# Altium project PCB-20062-001.PrjPcb
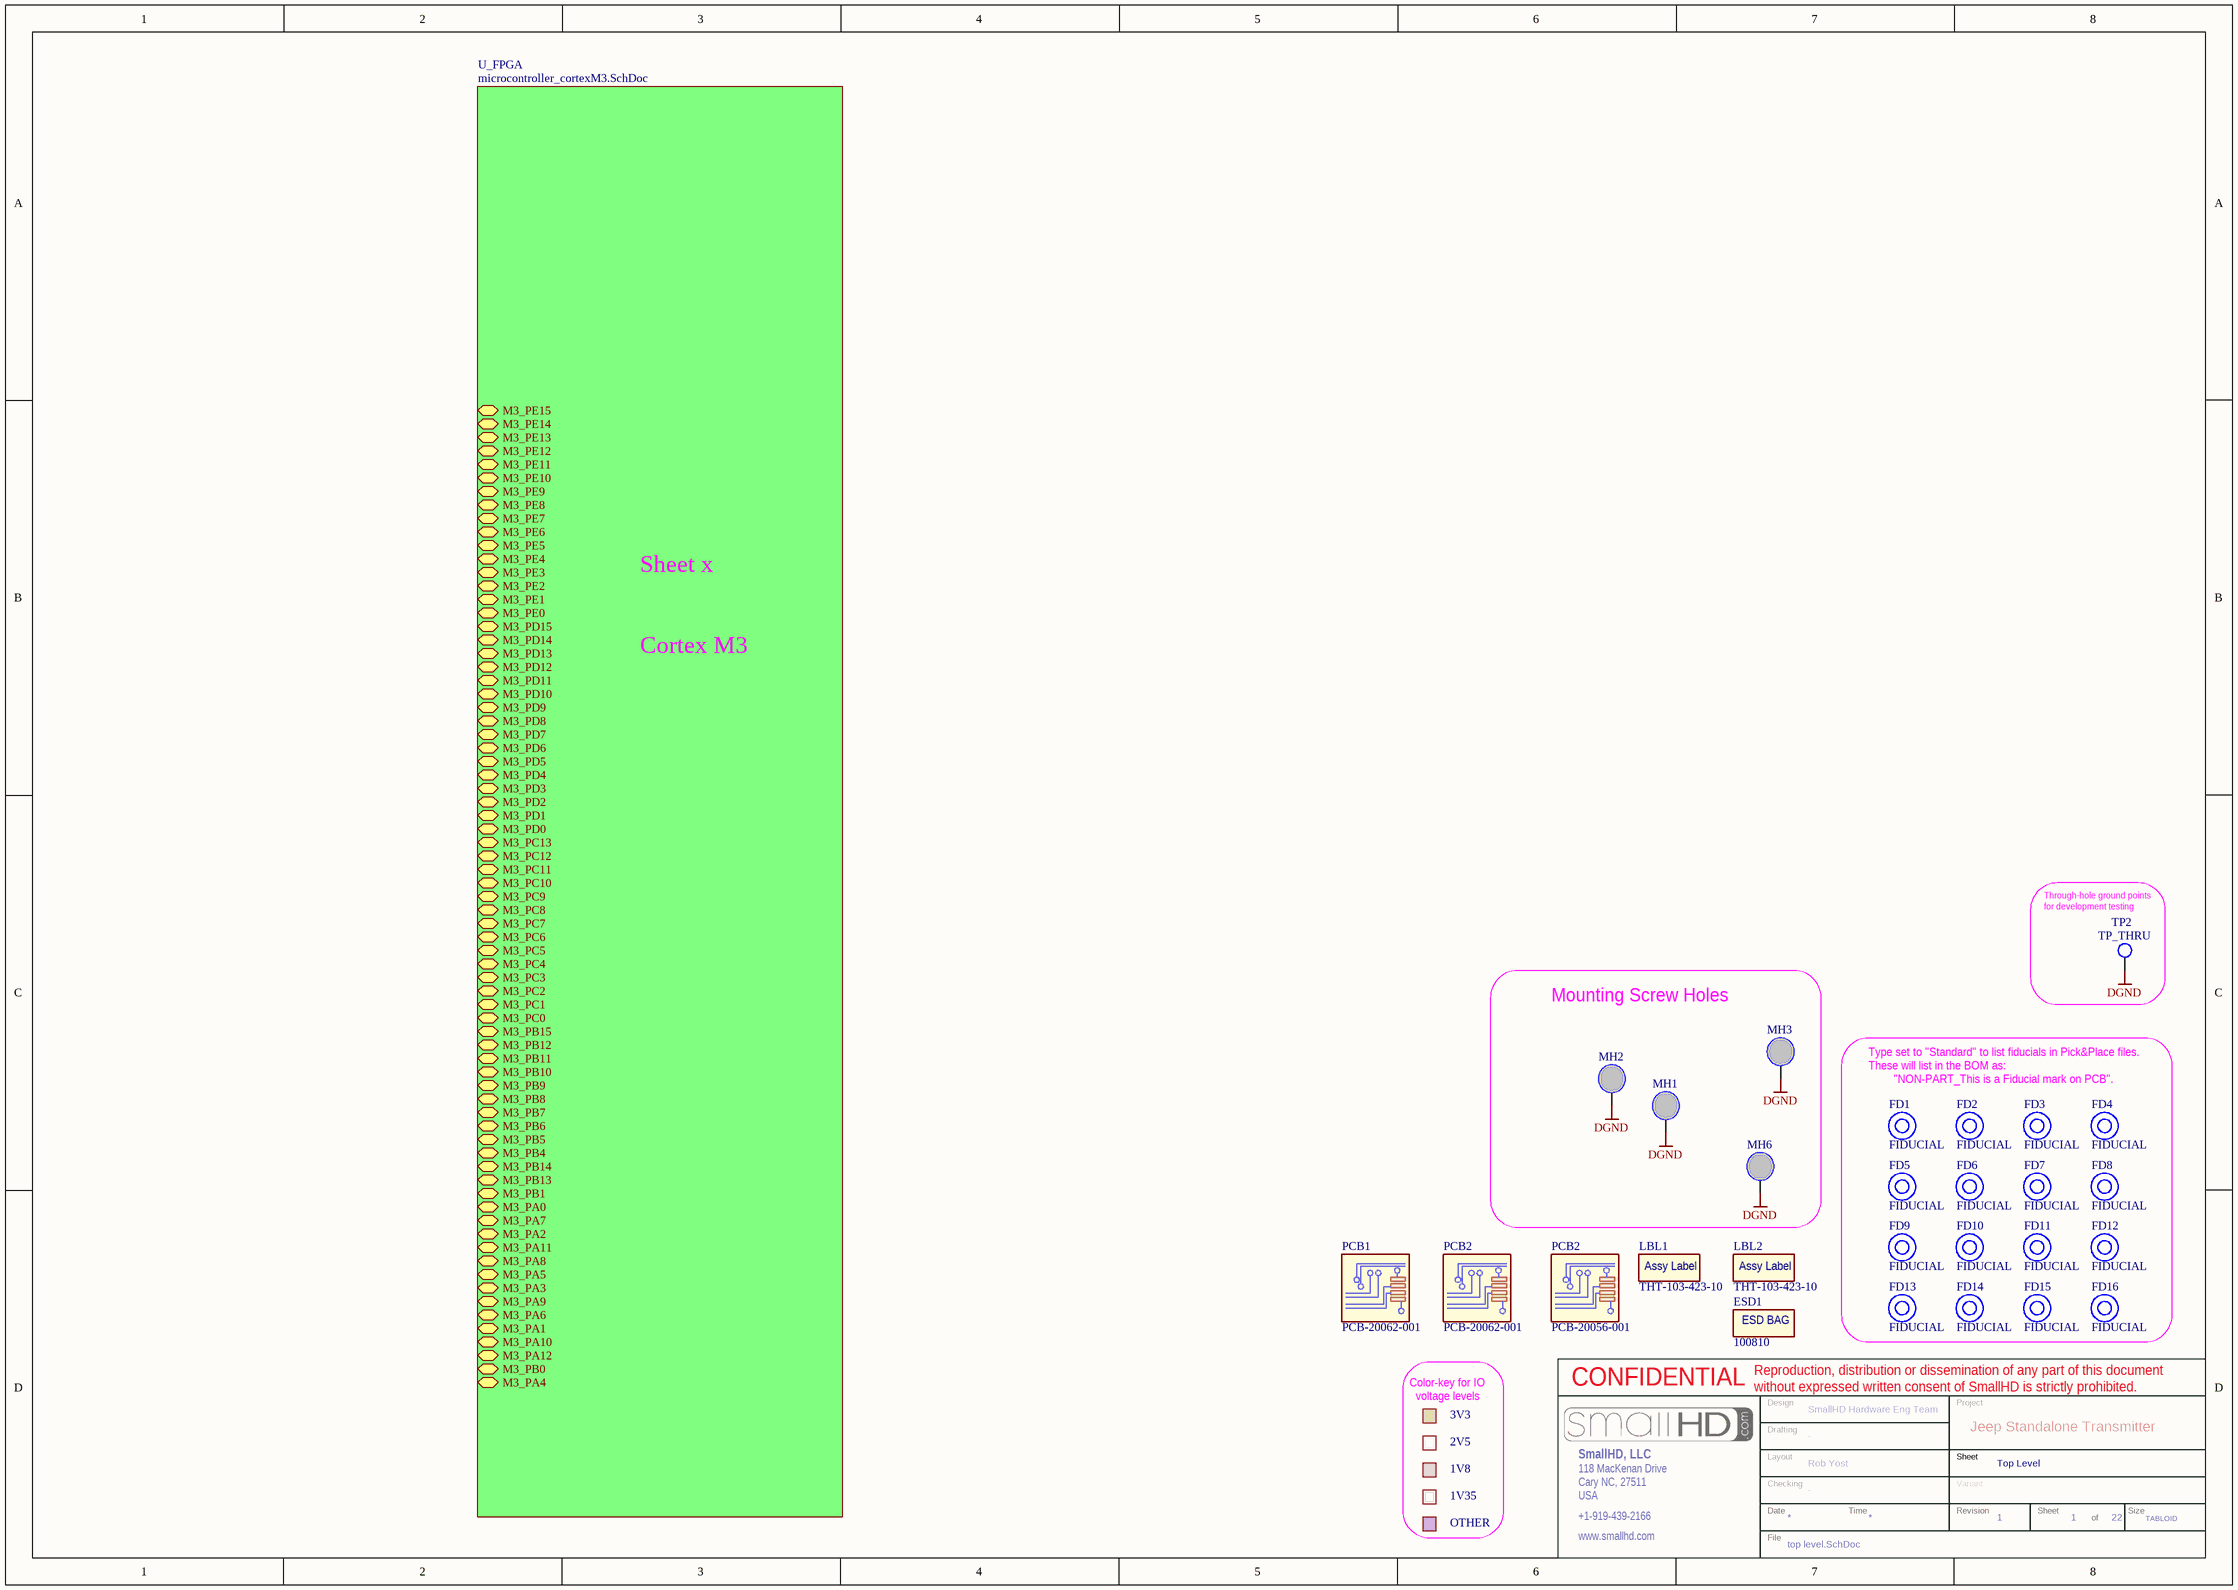
[diagram p0: top level.SchDoc]
Project_URL2: -; Project_URL1: www.smallhd.com; Project_SchemRev: 1; Project_Revision: 001; Project_ReviewedBy: SmallHD Hardware Eng Team; Project_Phone: +1-919-439-2166; Project_PCBRevision: 1; Project_PartNumber: PCB-20062-001; Project_LayoutBy: Rob Yost; Project_Freecall2: -; Project_Freecall1: -; Project_Filename: Jeep; Project_Fax: +1-919-882-0999; Project_DraftingBy: -; Project_DocRevision: 1; Project_DesignBy: SmallHD Hardware Eng Team; Project_Description: Jeep Standalone Transmitter; Project_ComponentsBy: -; Project_CheckingBy: -; Project_Board_Name: -; Project_Address5: -; Project_Address4: USA; Project_Address3: Cary NC, 27511; Project_Address2: 118 MacKenan Drive; Project_Address1: SmallHD, LLC
3 sheets, 88 parts. Net scope: hierarchical (ports join the sheet entries above them; power ports are global).
Board file: PCB-20062-001.PcbDoc
Sheets:
  top level.SchDoc
    U_FPGA = microcontroller_cortexM3.SchDoc
  ethernet.SchDoc

## Sheet top level.SchDoc: Top Level
size 419 x 297 mm; Layout: Rob Yost; Address6: Project_Address6; Components: -; ApprovedBy: -; CheckedBy: -; Author: SmallHD Hardware Eng Team; CompanyName: NOT USED; Address1: SmallHD, LLC; Address2: 118 MacKenan Drive; Address3: Cary NC, 27511; Address4: USA; DocumentNumber: 1; SheetNumber: 1; SheetTotal: 22; Address5: -; PageSetup: Record=PageOptions|CenterHorizontal=True|CenterVertical=True|PrintScale=1.00|XCorrection=1.00|YCorrection=1.00|PrintKind=0|BorderSize=5000000|LeftOffset=0|BottomOffset=0|Orientation=2|PaperLength=1000|PaperWidth=1000|Scale=100|PaperSource=7|PrintQuality=-4|MediaType=1|DitherType=10|PaperKind=A3|PrintScaleMode=0

### Parts
(Parts that share a designator on the sheet are numbered #1, #2 ... from top to bottom, then left to right.)
ESD1  100810  (mechanical)
FD1  FIDUCIAL  [FID10X20]
FD2  FIDUCIAL  [FID10X20]
FD3  FIDUCIAL  [FID10X20]
FD4  FIDUCIAL  [FID10X20]
FD5  FIDUCIAL  [FID10X20]
FD6  FIDUCIAL  [FID10X20]
FD7  FIDUCIAL  [FID10X20]
FD8  FIDUCIAL  [FID10X20]
FD9  FIDUCIAL  [FID10X20]
FD10  FIDUCIAL  [FID10X20]
FD11  FIDUCIAL  [FID10X20]
FD12  FIDUCIAL  [FID10X20]
FD13  FIDUCIAL  [FID10X20]
FD14  FIDUCIAL  [FID10X20]
FD15  FIDUCIAL  [FID10X20]
FD16  FIDUCIAL  [FID10X20]
LBL1  THT-103-423-10  [Assembly_Label_LBL1]
LBL2  THT-103-423-10  [Assembly_Label_LBL2]
MH1  SCREW-HOLE  [M3_buttonhead_hex]  (value not drawn)  (no BOM)
MH2  SCREW-HOLE  [M3_buttonhead_hex]  (value not drawn)  (no BOM)
MH3  SCREW-HOLE  [M3_buttonhead_hex]  (value not drawn)  (no BOM)
MH6  SCREW-HOLE  [M3_buttonhead_hex]  (value not drawn)  (no BOM)
PCB1  PCB-20062-001  [LOGO_SmallHD_4]
PCB2#1  PCB-20062-001  [LOGO_SmallHD_4]  (no BOM)
PCB2#2  PCB-20056-001  [LOGO_SmallHD_4]  (no BOM)
TP2  TP_THRU  [TP_THRU_1]  (no BOM)

### Sub-sheets
U_FPGA = microcontroller_cortexM3.SchDoc: M3_PE15 (bidir), M3_PE14 (bidir), M3_PE13 (bidir), M3_PE12 (bidir), M3_PE11 (bidir), M3_PE10 (bidir), M3_PE9 (bidir), M3_PE8 (bidir), M3_PE7 (bidir), M3_PE6 (bidir), M3_PE5 (bidir), M3_PE4 (bidir), M3_PE3 (bidir), M3_PE2 (bidir), M3_PE1 (bidir), M3_PE0 (bidir), M3_PD15 (bidir), M3_PD14 (bidir), M3_PD13 (bidir), M3_PD12 (bidir), M3_PD11 (bidir), M3_PD10 (bidir), M3_PD9 (bidir), M3_PD8 (bidir), M3_PD7 (bidir), M3_PD6 (bidir), M3_PD5 (bidir), M3_PD4 (bidir), M3_PD3 (bidir), M3_PD2 (bidir), M3_PD1 (bidir), M3_PD0 (bidir), M3_PC13 (bidir), M3_PC12 (bidir), M3_PC11 (bidir), M3_PC10 (bidir), M3_PC9 (bidir), M3_PC8 (bidir), M3_PC7 (bidir), M3_PC6 (bidir), M3_PC5 (bidir), M3_PC4 (bidir), M3_PC3 (bidir), M3_PC2 (bidir), M3_PC1 (bidir), M3_PC0 (bidir), M3_PB15 (bidir), M3_PB12 (bidir), M3_PB11 (bidir), M3_PB10 (bidir), M3_PB9 (bidir), M3_PB8 (bidir), M3_PB7 (bidir), M3_PB6 (bidir), M3_PB5 (bidir), M3_PB4 (bidir), M3_PB14 (bidir), M3_PB13 (bidir), M3_PB1 (bidir), M3_PA0 (bidir), M3_PA7 (bidir), M3_PA2 (bidir), M3_PA11 (bidir), M3_PA8 (bidir), M3_PA5 (bidir), M3_PA3 (bidir), M3_PA9 (bidir), M3_PA6 (bidir), M3_PA1 (bidir), M3_PA10 (bidir), M3_PA12 (bidir), M3_PB0 (bidir), M3_PA4 (bidir)  | 1: Sheet x; 4: Cortex M3

### Nets
DGND: MH1.1 MH2.1 MH3.1 MH6.1 TP2.1

Not connected (* = marked no-connect by the designer): FD1 0; FD2 0; FD3 0; FD4 0; FD5 0; FD6 0; FD7 0; FD8 0; FD9 0; FD10 0; FD11 0; FD12 0; FD13 0; FD14 0; FD15 0; FD16 0

### Notes on the sheet
- (near TP2) Through-hole ground points
  for development testing
- Mounting Screw Holes
- Type set to "Standard" to list fiducials in Pick&Place files.
  These will list in the BOM as:
  "NON-PART_This is a Fiducial mark on PCB".
- Color-key for IO
  voltage levels
- 3V3
- 2V5
- 1V8
- OTHER
- 1V35
- CONFIDENTIAL
- Reproduction, distribution or dissemination of any part of this document without expressed written consent of SmallHD is strictly prohibited.
- Design
- Project
- Drafting
- Layout
- Sheet
- Date
- File
- Checking
- Time
- Variant
- Revision
- of
- Size
- TABLOID
- (in symbol ESD-20001-001) ESD BAG
- (in symbol LBL-20002-001) Assy Label
- (in symbol LBL-20003-001) Assy Label

### Library data of the parts
ESD1 = ESD-20001-001: BAG STATIC METL-IN 8X10" OPEN TOP; Manufacturer: SCS; Display_Name: 100810; Schematic Symbol: ESDBAG_1; smallHD PN: ESD-20001-001; Manufacturer Part Number: 100810
FD1-FD16 = NPT-20003-001: NON-PART_This is a Fiducial mark on PCB; Display_Name: FIDUCIAL; Schematic Symbol: FIDUCIAL_BOMandPick&Place; smallHD PN: NPT-20003-001
LBL1 = LBL-20002-001: LABEL 1.0 x 0.25 inch Thermal polyester; Manufacturer: Brady; Display_Name: THT-103-423-10; smallHD PN: LBL-20002-001; Manufacturer Part Number: THT-103-423-10
LBL2 = LBL-20003-001: LABEL 1.0 x 0.25 inch Thermal polyester; Manufacturer: Brady; Display_Name: THT-103-423-10; smallHD PN: LBL-20003-001; Manufacturer Part Number: THT-103-423-10
MH1-MH3 MH6 = NPT-20017-001: M3 x 0.5 mm Button-Head Socket Cap Screw 2 mm Hex; Display_Name: SCREW-HOLE; smallHD PN: NPT-20017-001; Display Footprint: M3_buttonhead_hex
PCB1 PCB2#1 = PCB-20062-001: PCB Jeep REV 001; Manufacturer: PCB FAB; Schematic Symbol: PCB_1; smallHD PN: PCB-20062-001; Manufacturer Part Number: PCB-20062-001; Display_Name: PCB-20062-001
PCB2#2 = PCB-20056-001: PCB Fiesta-5W SDI MAIN REV 001; Manufacturer: PCB FAB; Schematic Symbol: PCB_1; smallHD PN: PCB-20056-001; Manufacturer Part Number: PCB-20056-001; Display_Name: PCB-20056-001
TP2 = NPT-20014-001: Test Point - THRU; Display_Name: TP_THRU; Schematic Symbol: TP_1; smallHD PN: NPT-20014-001; Display Footprint: TP_THRU

## Sheet microcontroller_cortexM3.SchDoc: Cortex M3 Microcontroller
size 419 x 297 mm; Layout: Rob Yost; Address6: Project_Address6; Components: -; ApprovedBy: -; CheckedBy: -; Author: SmallHD Hardware Eng Team; CompanyName: NOT USED; Address1: SmallHD, LLC; Address2: 118 MacKenan Drive; Address3: Cary NC, 27511; Address4: USA; DocumentNumber: 22; SheetNumber: 22; SheetTotal: 22; Address5: -; PageSetup: Record=PageOptions|CenterHorizontal=True|CenterVertical=True|PrintScale=1.00|XCorrection=1.00|YCorrection=1.00|PrintKind=0|BorderSize=5000000|LeftOffset=0|BottomOffset=0|Orientation=2|PaperLength=1000|PaperWidth=1000|Scale=100|PaperSource=7|PrintQuality=-4|MediaType=1|DitherType=10|PaperKind=A3|PrintScaleMode=0
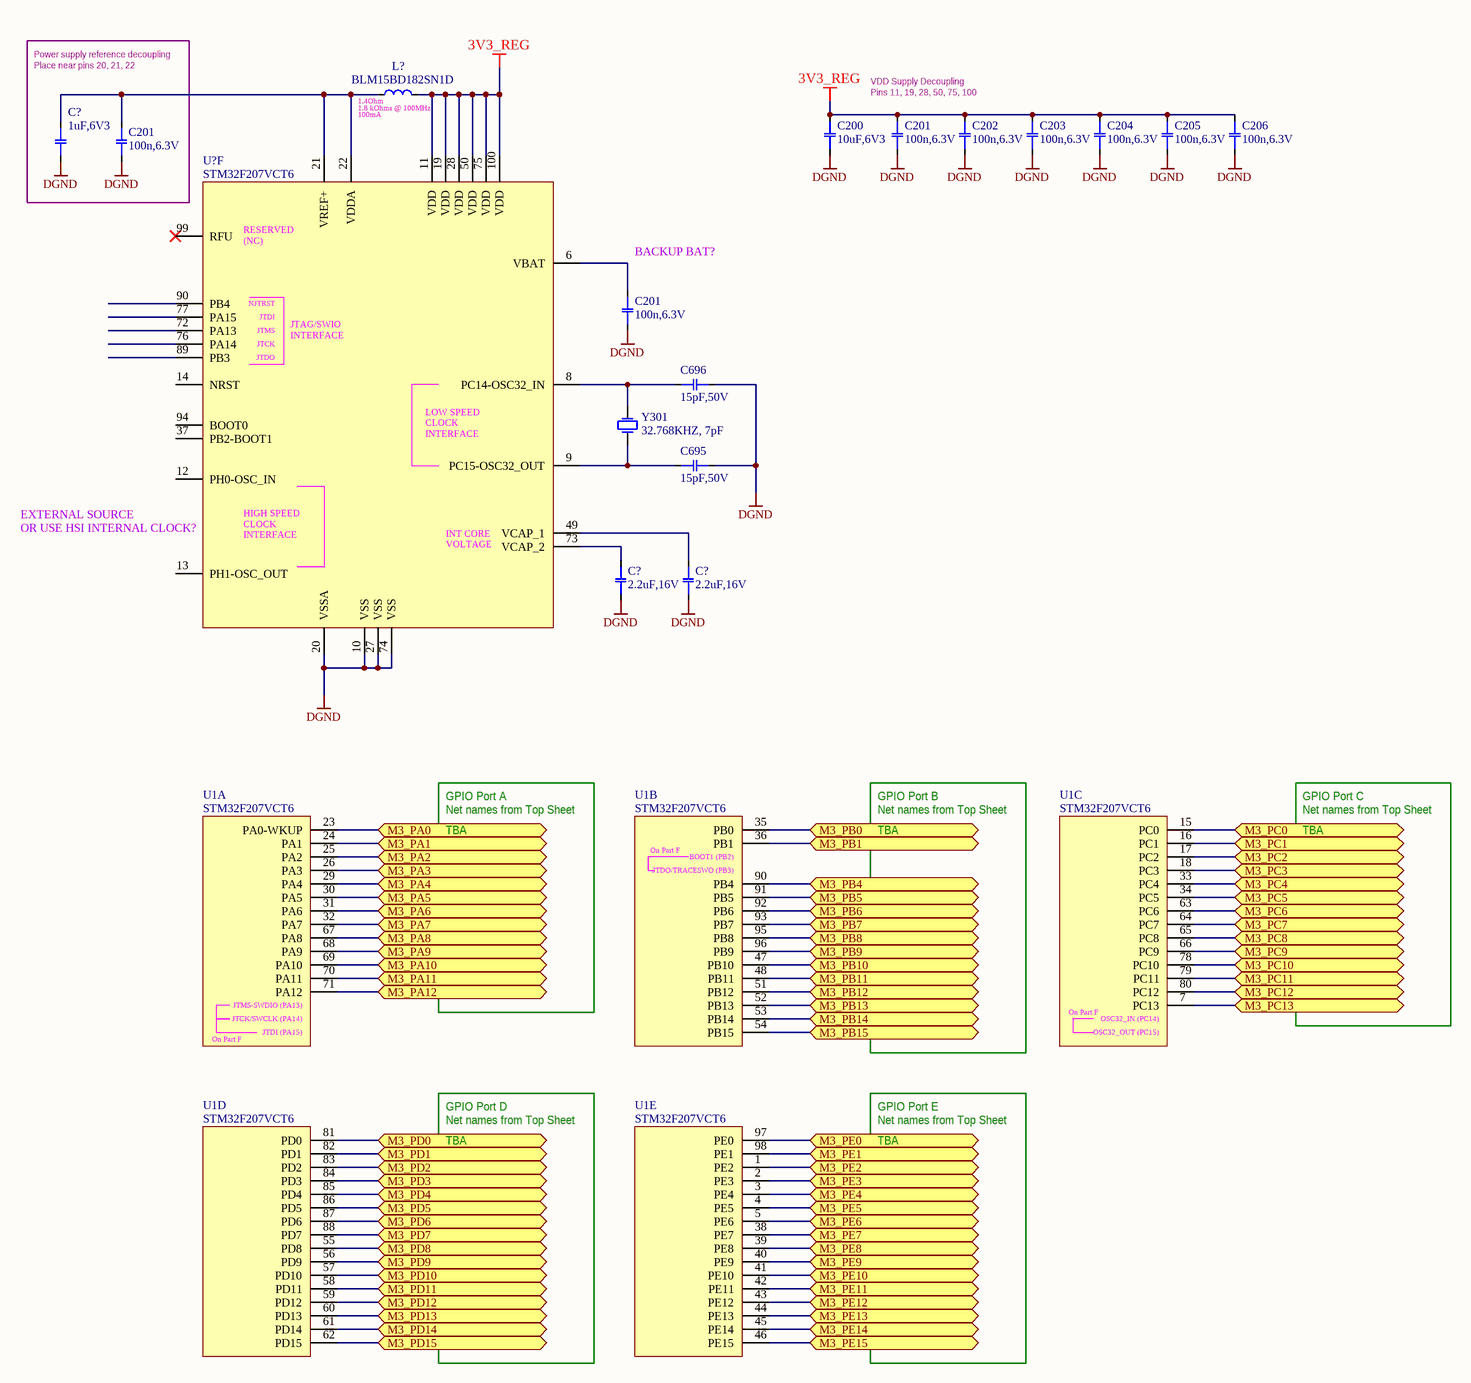
[diagram p1: microcontroller_cortexM3.SchDoc]

### Parts
(Parts that share a designator on the sheet are numbered #1, #2 ... from top to bottom, then left to right.)
C200  10uF,6V3  [CAPC1608X10N_0603]
C201#1  100n,6.3V  [CAPC0603X03L_0201]
C201#2  100n,6.3V  [CAPC0603X03L_0201]
C201#3  100n,6.3V  [CAPC0603X03L_0201]
C202  100n,6.3V  [CAPC0603X03L_0201]
C203  100n,6.3V  [CAPC0603X03L_0201]
C204  100n,6.3V  [CAPC0603X03L_0201]
C205  100n,6.3V  [CAPC0603X03L_0201]
C206  100n,6.3V  [CAPC0603X03L_0201]
C695  15pF,50V  [CAPC1005X05N_0402]
C696  15pF,50V  [CAPC1005X05N_0402]
C?#1  1uF,6V3  [CAPC1005X06N_0402]
C?#2  2.2uF,16V  [CAPC1005X06N_0402]
C?#3  2.2uF,16V  [CAPC1005X06N_0402]
L?  BLM15BD182SN1D  Current Rating: 100mA  DC Resistance: 1.4Ohm  Impedance @ Frequency: 1.8 kOhms @ 100MHz  [INDC1005X06N_0402]
U1  STM32F207VCT6  [LQFP50P1600X1600X160-100N]  (parts A,B,C,D,E of 6)
U?  STM32F207VCT6  [LQFP50P1600X1600X160-100N]  (part F of 6)
Y301  32.768KHZ, 7pF  [XTAL_ABS07]

### Ports
M3_PA0 (bidir), M3_PA1 (bidir), M3_PA2 (bidir), M3_PA3 (bidir), M3_PA4 (bidir), M3_PA5 (bidir), M3_PA6 (bidir), M3_PA7 (bidir), M3_PA8 (bidir), M3_PA9 (bidir), M3_PA10 (bidir), M3_PA11 (bidir), M3_PA12 (bidir), M3_PB0 (bidir), M3_PB1 (bidir), M3_PB4 (bidir), M3_PB5 (bidir), M3_PB6 (bidir), M3_PB7 (bidir), M3_PB8 (bidir), M3_PB9 (bidir), M3_PB10 (bidir), M3_PB11 (bidir), M3_PB12 (bidir), M3_PB13 (bidir), M3_PB14 (bidir), M3_PB15 (bidir), M3_PC0 (bidir), M3_PC1 (bidir), M3_PC2 (bidir), M3_PC3 (bidir), M3_PC4 (bidir), M3_PC5 (bidir), M3_PC6 (bidir), M3_PC7 (bidir), M3_PC8 (bidir), M3_PC9 (bidir), M3_PC10 (bidir), M3_PC11 (bidir), M3_PC12 (bidir), M3_PC13 (bidir), M3_PD0 (bidir), M3_PD1 (bidir), M3_PD2 (bidir), M3_PD3 (bidir), M3_PD4 (bidir), M3_PD5 (bidir), M3_PD6 (bidir), M3_PD7 (bidir), M3_PD8 (bidir), M3_PD9 (bidir), M3_PD10 (bidir), M3_PD11 (bidir), M3_PD12 (bidir), M3_PD13 (bidir), M3_PD14 (bidir), M3_PD15 (bidir), M3_PE0 (bidir), M3_PE1 (bidir), M3_PE2 (bidir), M3_PE3 (bidir), M3_PE4 (bidir), M3_PE5 (bidir), M3_PE6 (bidir), M3_PE7 (bidir), M3_PE8 (bidir), M3_PE9 (bidir), M3_PE10 (bidir), M3_PE11 (bidir), M3_PE12 (bidir), M3_PE13 (bidir), M3_PE14 (bidir), M3_PE15 (bidir)

### Nets
3V3_REG: C200.2 C201#1.2 C202.2 C203.2 C204.2 C205.2 C206.2 L?.2 U?.11(VDD) U?.19(VDD) U?.28(VDD) U?.50(VDD) U?.75(VDD) U?.100(VDD)
DGND: C200.1 C201#1.1 C201#2.1 C201#3.1 C202.1 C203.1 C204.1 C205.1 C206.1 C695.1 C696.1 C?#1.1 C?#2.1 C?#3.1 U?.10(VSS) U?.20(VSSA) U?.27(VSS) U?.74(VSS)
NetC201#2_2: C201#2.2 C?#1.2 L?.1 U?.21(VREF+) U?.22(VDDA)
NetC201#3_2: C201#3.2 U?.6(VBAT)
NetC695_2: C695.2 U?.9(PC15-OSC32_OUT) Y301.1
NetC696_2: C696.2 U?.8(PC14-OSC32_IN) Y301.2
NetC?#2_2: C?#2.2 U?.73(VCAP_2)
NetC?#3_2: C?#3.2 U?.49(VCAP_1)
NetU1_1: U1.1(PE2) ; port M3_PE2
NetU1_2: U1.2(PE3) ; port M3_PE3
NetU1_3: U1.3(PE4) ; port M3_PE4
NetU1_4: U1.4(PE5) ; port M3_PE5
NetU1_5: U1.5(PE6) ; port M3_PE6
NetU1_7: U1.7(PC13) ; port M3_PC13
NetU1_15: U1.15(PC0) ; port M3_PC0
NetU1_16: U1.16(PC1) ; port M3_PC1
NetU1_17: U1.17(PC2) ; port M3_PC2
NetU1_18: U1.18(PC3) ; port M3_PC3
NetU1_23: U1.23(PA0-WKUP) ; port M3_PA0
NetU1_24: U1.24(PA1) ; port M3_PA1
NetU1_25: U1.25(PA2) ; port M3_PA2
NetU1_26: U1.26(PA3) ; port M3_PA3
NetU1_29: U1.29(PA4) ; port M3_PA4
NetU1_30: U1.30(PA5) ; port M3_PA5
NetU1_31: U1.31(PA6) ; port M3_PA6
NetU1_32: U1.32(PA7) ; port M3_PA7
NetU1_33: U1.33(PC4) ; port M3_PC4
NetU1_34: U1.34(PC5) ; port M3_PC5
NetU1_35: U1.35(PB0) ; port M3_PB0
NetU1_36: U1.36(PB1) ; port M3_PB1
NetU1_38: U1.38(PE7) ; port M3_PE7
NetU1_39: U1.39(PE8) ; port M3_PE8
NetU1_40: U1.40(PE9) ; port M3_PE9
NetU1_41: U1.41(PE10) ; port M3_PE10
NetU1_42: U1.42(PE11) ; port M3_PE11
NetU1_43: U1.43(PE12) ; port M3_PE12
NetU1_44: U1.44(PE13) ; port M3_PE13
NetU1_45: U1.45(PE14) ; port M3_PE14
NetU1_46: U1.46(PE15) ; port M3_PE15
NetU1_47: U1.47(PB10) ; port M3_PB10
NetU1_48: U1.48(PB11) ; port M3_PB11
NetU1_51: U1.51(PB12) ; port M3_PB12
NetU1_52: U1.52(PB13) ; port M3_PB13
NetU1_53: U1.53(PB14) ; port M3_PB14
NetU1_54: U1.54(PB15) ; port M3_PB15
NetU1_55: U1.55(PD8) ; port M3_PD8
NetU1_56: U1.56(PD9) ; port M3_PD9
NetU1_57: U1.57(PD10) ; port M3_PD10
NetU1_58: U1.58(PD11) ; port M3_PD11
NetU1_59: U1.59(PD12) ; port M3_PD12
NetU1_60: U1.60(PD13) ; port M3_PD13
NetU1_61: U1.61(PD14) ; port M3_PD14
NetU1_62: U1.62(PD15) ; port M3_PD15
NetU1_63: U1.63(PC6) ; port M3_PC6
NetU1_64: U1.64(PC7) ; port M3_PC7
NetU1_65: U1.65(PC8) ; port M3_PC8
NetU1_66: U1.66(PC9) ; port M3_PC9
NetU1_67: U1.67(PA8) ; port M3_PA8
NetU1_68: U1.68(PA9) ; port M3_PA9
NetU1_69: U1.69(PA10) ; port M3_PA10
NetU1_70: U1.70(PA11) ; port M3_PA11
NetU1_71: U1.71(PA12) ; port M3_PA12
NetU1_78: U1.78(PC10) ; port M3_PC10
NetU1_79: U1.79(PC11) ; port M3_PC11
NetU1_80: U1.80(PC12) ; port M3_PC12
NetU1_81: U1.81(PD0) ; port M3_PD0
NetU1_82: U1.82(PD1) ; port M3_PD1
NetU1_83: U1.83(PD2) ; port M3_PD2
NetU1_84: U1.84(PD3) ; port M3_PD3
NetU1_85: U1.85(PD4) ; port M3_PD4
NetU1_86: U1.86(PD5) ; port M3_PD5
NetU1_87: U1.87(PD6) ; port M3_PD6
NetU1_88: U1.88(PD7) ; port M3_PD7
NetU1_90: U1.90(PB4) ; port M3_PB4
NetU1_91: U1.91(PB5) ; port M3_PB5
NetU1_92: U1.92(PB6) ; port M3_PB6
NetU1_93: U1.93(PB7) ; port M3_PB7
NetU1_95: U1.95(PB8) ; port M3_PB8
NetU1_96: U1.96(PB9) ; port M3_PB9
NetU1_97: U1.97(PE0) ; port M3_PE0
NetU1_98: U1.98(PE1) ; port M3_PE1

Not connected (* = marked no-connect by the designer): U? 12(PH0-OSC_IN) 13(PH1-OSC_OUT) 14(NRST) 37(PB2-BOOT1) 72(PA13) 76(PA14) 77(PA15) 89(PB3) 90(PB4) 94(BOOT0) 99(RFU)*

### Notes on the sheet
- Power supply reference decoupling
  Place near pins 20, 21, 22
- VDD Supply Decoupling
  Pins 11, 19, 28, 50, 75, 100
- (near C201#3) BACKUP BAT?
- (near U?) EXTERNAL SOURCE
  OR USE HSI INTERNAL CLOCK?
- Net names from Top Sheet
- GPIO Port A
- GPIO Port B
- GPIO Port C
- TBA
- GPIO Port D
- GPIO Port E
- CONFIDENTIAL
- Reproduction, distribution or dissemination of any part of this document without expressed written consent of SmallHD is strictly prohibited.
- Design
- Project
- Drafting
- Layout
- Sheet
- Date
- File
- Checking
- Time
- Variant
- Revision
- of
- Size
- TABLOID
- (in symbol ICT-20168-001, part A) JTMS-SWDIO (PA13); JTCK/SWCLK (PA14); JTDI (PA15); On Part F
- (in symbol ICT-20168-001, part B) On Part F; BOOT1 (PB2); JTDO/TRACESWO (PB3)
- (in symbol ICT-20168-001, part C) On Part F; OSC32_IN (PC14); OSC32_OUT (PC15)
- (in symbol ICT-20168-001, part F) RESERVED (NC); NJTRST; JTDI; JTMS; JTCK; JTAG/SWIO / INTERFACE; JTDO; LOW SPEED / CLOCK INTERFACE /; HIGH SPEED / CLOCK INTERFACE /; INT CORE / VOLTAGE

### Library data of the parts
C200 = CAP-20026-101: CAP CER 10UF 6.3V 20% X5R 0603; Manufacturer: TDK; Manufacturer Part Number: C1608X5R0J106M080AB; Manufacturer-2 Part Number: GRM188R60J106ME47J; Capacitance: 0.1uF; Type: Ceramic; Display_Name: 10uF,6V3; Dielectric: X5R; Tolerance: 20%; Voltage: 6.3V; Manufacturer-2: Murata; Schematic Symbol: CAP-NP_1; smallHD PN: CAP-20026-101
C201#1-C201#3 C202-C206 = CAP-20025-101: CAP CER 0.1UF 6.3V 20% X5R 0201; Manufacturer: TDK; Manufacturer Part Number: C0603X5R0J104M030BC; Manufacturer-2 Part Number: GRM033R60J104ME19D; Type: Ceramic; Display_Name: 100n,6.3V; Capacitance: 0.1uF; Dielectric: X5R; Tolerance: 20%; Voltage: 6.3V; Manufacturer-2: Murata; Schematic Symbol: CAP-NP_1; smallHD PN: CAP-20025-101
C695 C696 = CAP-20029-101: CAP CER 15PF 50V 5% NPO 0402; Manufacturer: Yageo; Manufacturer Part Number: CC0402JRNPO9BN150; Manufacturer-2 Part Number: GRM1555C1E150JA01D; Type: Ceramic; Display Footprint: 0402; Display_Name: 15pF,50V; Capacitance: 15pF; Dielectric: NPO; Tolerance: 5%; Voltage: 50V; Schematic Symbol: CAP-NP_1; Manufacturer-2: Murata; smallHD PN: CAP-20029-101
C?#1 = CAP-20023-101: CAP CER 1UF 6.3V 10% X5R 0402; Manufacturer: AVX; Manufacturer Part Number: 04026D105KAT2A; Manufacturer-2 Part Number: GRM155R60J105KE19D; Capacitance: 1.0uF; Type: Ceramic; Display Footprint: 0402; Display_Name: 1uF,6V3; Dielectric: X5R; Tolerance: 10%; Voltage: 6.3V; Schematic Symbol: CAP-NP_1; smallHD PN: CAP-20023-101; Thickness (Max): 0.56mm; Manufacturer-2: Murata
C?#2 C?#3 = CAP-20053-001: CAP CER 2.2uF 16V X5R 0402; Manufacturer: Murata; Manufacturer Part Number: GRM155R61C225KE11D; Tolerance: 10%; Type: Ceramic; Display Footprint: 0402; Display_Name: 2.2uF,16V; Capacitance: 2.2uF; Dielectric: X5R; Voltage: 16V; Schematic Symbol: CAP-NP_1; smallHD PN: CAP-20053-001; Thickness (Max): 0.55mm
L? = IND-20049-001: FERRITE BEAD 1.8 KOHM 0402 1LN; Manufacturer: Murata; Flex Footprint 1: INDC1005X06N_0402_FLEX; Display Footprint: 0402; Display_Name: BLM15BD182SN1D; Schematic Symbol: INDUCTOR_1; smallHD PN: IND-20049-001; Thickness (Max): 0.55mm; Manufacturer Part Number: BLM15BD182SN1D
U1 U? = ICT-20168-001: IC MCU 32BIT 256KB FLASH 100LQFP; Manufacturer: STMicroelectronics; Temp Range: -40°C ~ 85°C; Display Footprint: 100-LQFP; Display_Name: STM32F207VCT6; smallHD PN: ICT-20168-001; Manufacturer Part Number: STM32F207VCT6
Y301 = XTL-20001-001: CRYSTAL 32.768KHZ 7PF SMD; Manufacturer: Abracon Corporation; Manufacturer Part Number: ABS07-32.768KHZ-7-T; Accuracy: +-20ppm; Frequency: 32768Hz; Display Footprint: ABS07; Display_Name: 32.768KHZ, 7pF; Load Capacitance: 7pF; Schematic Symbol: XTAL_1; smallHD PN: XTL-20001-001

## Sheet ethernet.SchDoc: Ethernet
size 419 x 297 mm; Layout: Rob Yost; Address6: Project_Address6; Components: -; ApprovedBy: -; CheckedBy: -; Author: SmallHD Hardware Eng Team; CompanyName: NOT USED; Address1: SmallHD, LLC; Address2: 118 MacKenan Drive; Address3: Cary NC, 27511; Address4: USA; DocumentNumber: 24; SheetNumber: 24; SheetTotal: 29; Address5: -; PageSetup: Record=PageOptions|CenterHorizontal=True|CenterVertical=True|PrintScale=1.00|XCorrection=1.00|YCorrection=1.00|PrintKind=0|BorderSize=5000000|LeftOffset=0|BottomOffset=0|Orientation=2|PaperLength=1000|PaperWidth=1000|Scale=100|PaperSource=7|PrintQuality=-4|MediaType=1|DitherType=10|PaperKind=A3|PrintScaleMode=0
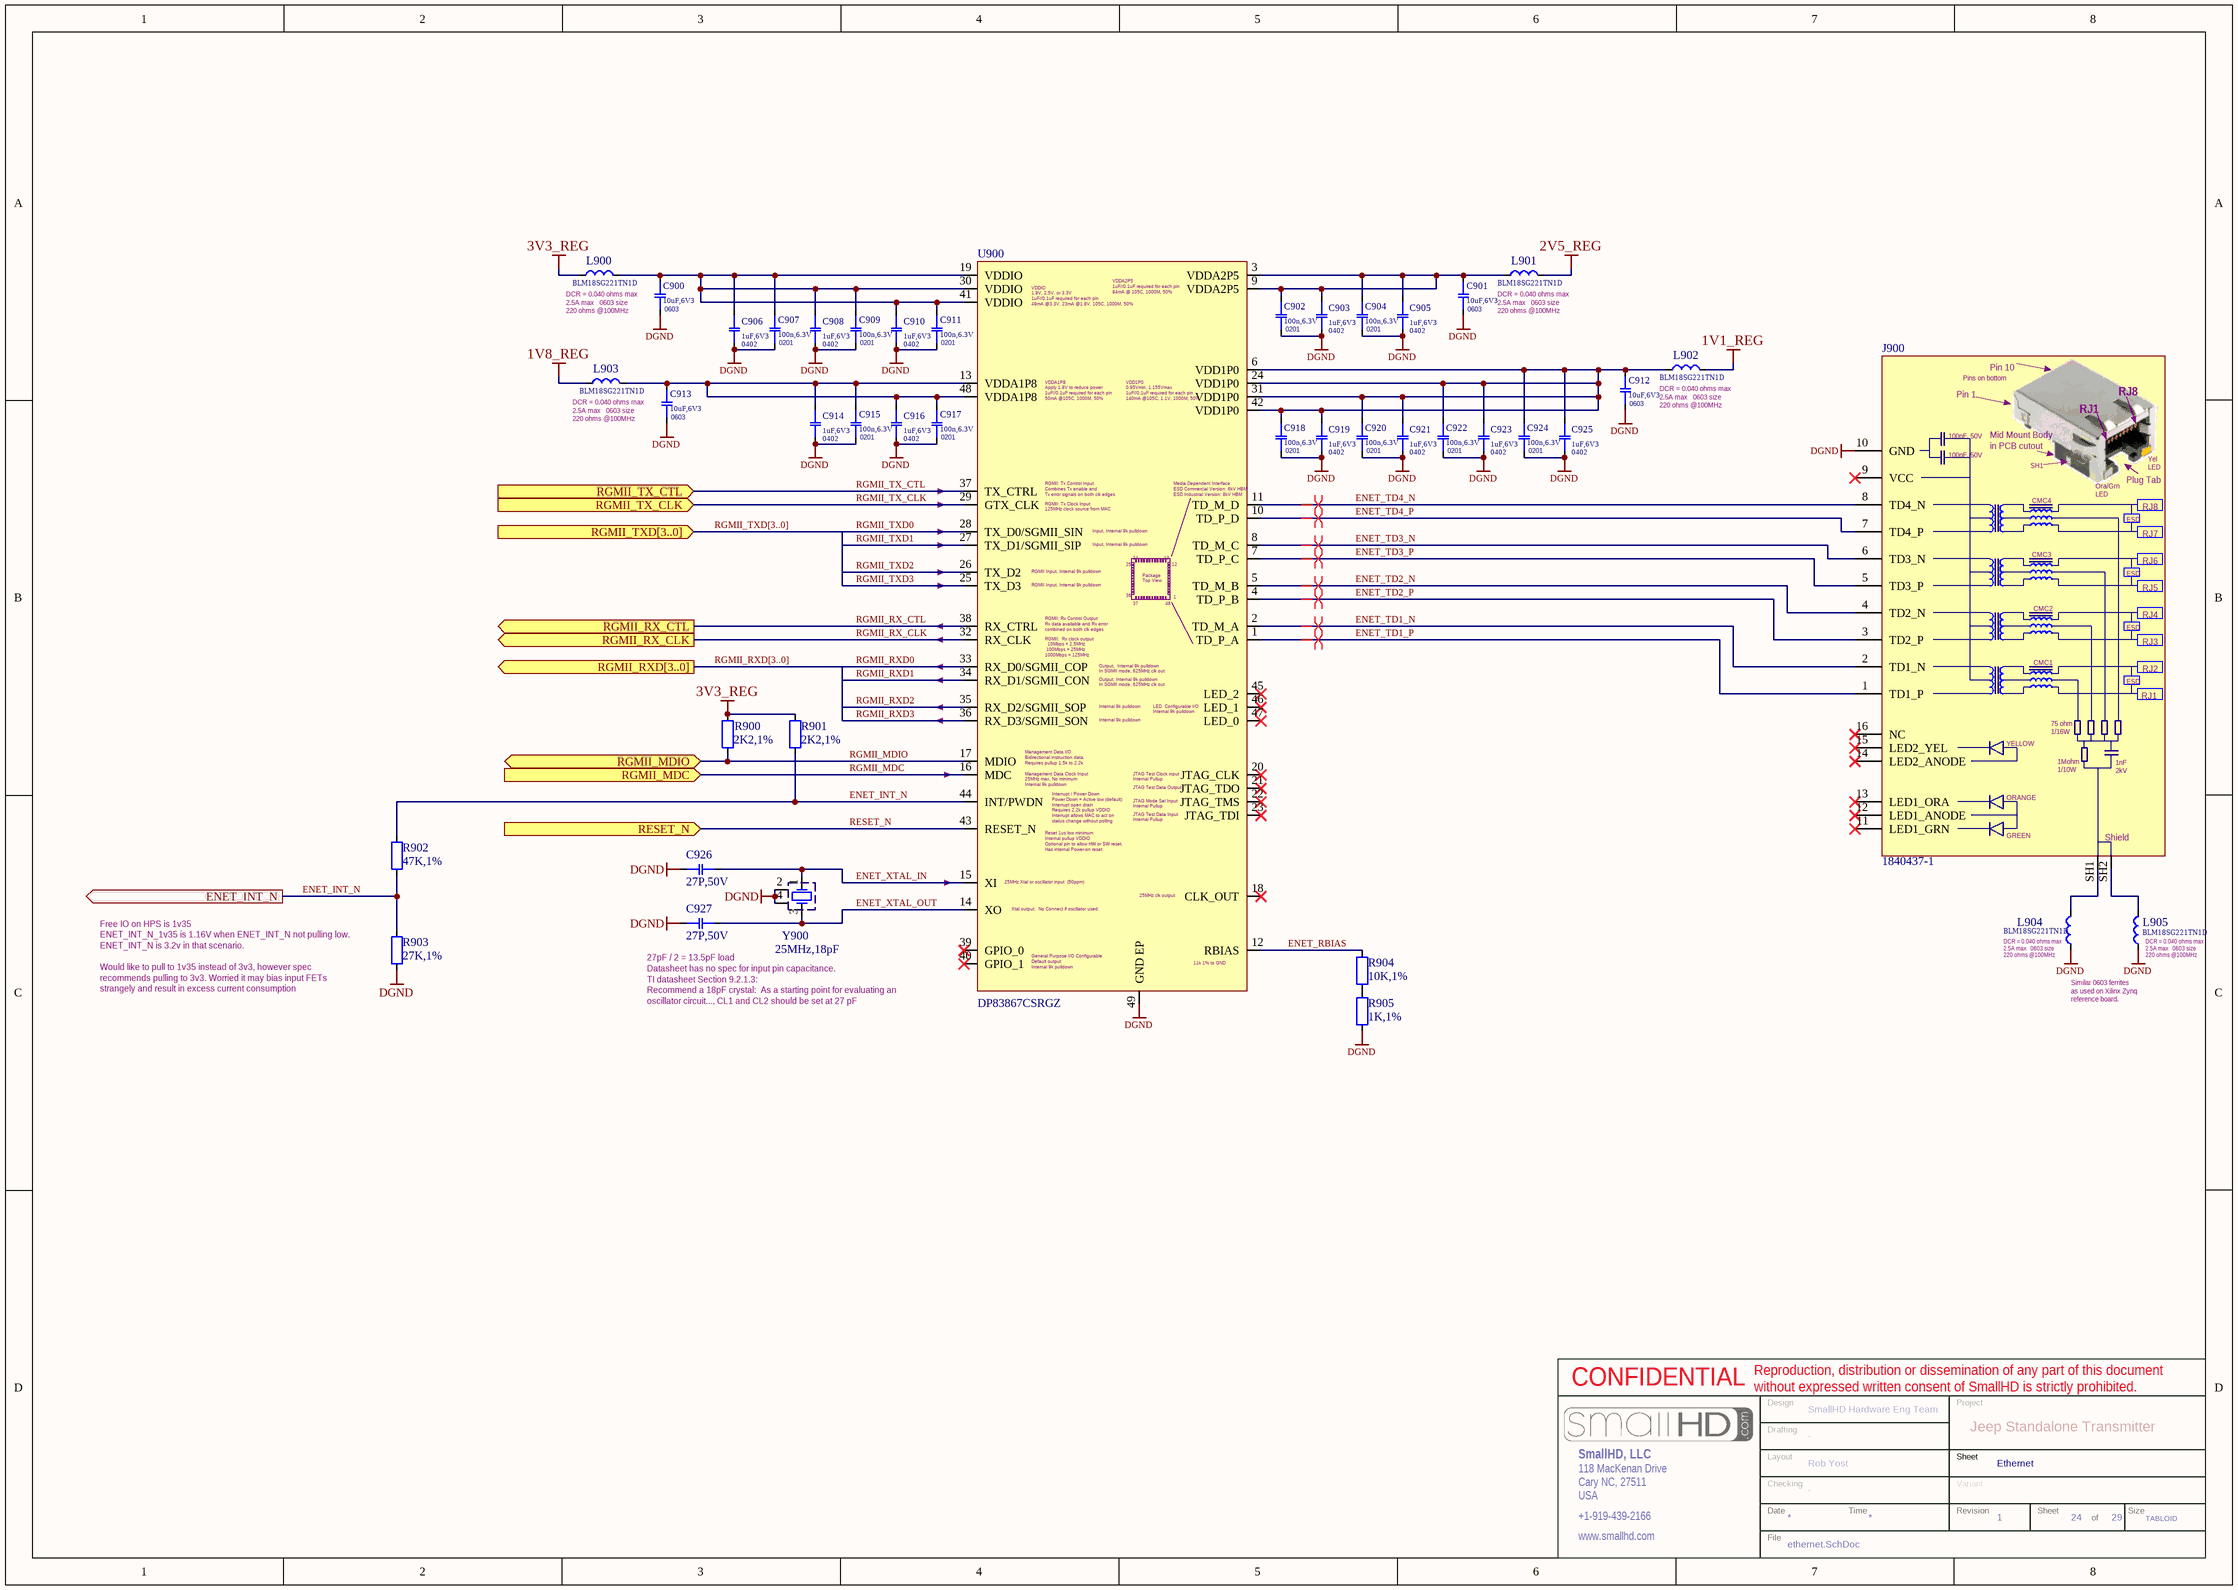
[diagram p2: ethernet.SchDoc]

### Parts
C900  10uF,6V3  Display Footprint: 0603  [CAPC1608X10N_0603]
C901  10uF,6V3  Display Footprint: 0603  [CAPC1608X10N_0603]
C902  100n,6.3V  Display Footprint: 0201  [CAPC0603X03L_0201]
C903  1uF,6V3  Display Footprint: 0402  [CAPC1005X06N_0402]
C904  100n,6.3V  Display Footprint: 0201  [CAPC0603X03L_0201]
C905  1uF,6V3  Display Footprint: 0402  [CAPC1005X06N_0402]
C906  1uF,6V3  Display Footprint: 0402  [CAPC1005X06N_0402]
C907  100n,6.3V  Display Footprint: 0201  [CAPC0603X03L_0201]
C908  1uF,6V3  Display Footprint: 0402  [CAPC1005X06N_0402]
C909  100n,6.3V  Display Footprint: 0201  [CAPC0603X03L_0201]
C910  1uF,6V3  Display Footprint: 0402  [CAPC1005X06N_0402]
C911  100n,6.3V  Display Footprint: 0201  [CAPC0603X03L_0201]
C912  10uF,6V3  Display Footprint: 0603  [CAPC1608X10N_0603]
C913  10uF,6V3  Display Footprint: 0603  [CAPC1608X10N_0603]
C914  1uF,6V3  Display Footprint: 0402  [CAPC1005X06N_0402]
C915  100n,6.3V  Display Footprint: 0201  [CAPC0603X03L_0201]
C916  1uF,6V3  Display Footprint: 0402  [CAPC1005X06N_0402]
C917  100n,6.3V  Display Footprint: 0201  [CAPC0603X03L_0201]
C918  100n,6.3V  Display Footprint: 0201  [CAPC0603X03L_0201]
C919  1uF,6V3  Display Footprint: 0402  [CAPC1005X06N_0402]
C920  100n,6.3V  Display Footprint: 0201  [CAPC0603X03L_0201]
C921  1uF,6V3  Display Footprint: 0402  [CAPC1005X06N_0402]
C922  100n,6.3V  Display Footprint: 0201  [CAPC0603X03L_0201]
C923  1uF,6V3  Display Footprint: 0402  [CAPC1005X06N_0402]
C924  100n,6.3V  Display Footprint: 0201  [CAPC0603X03L_0201]
C925  1uF,6V3  Display Footprint: 0402  [CAPC1005X06N_0402]
C926  27P,50V  [CAPC0603X03L_0201]
C927  27P,50V  [CAPC0603X03L_0201]
J900  1840437-1  [BEL_1840437-1]
L900  BLM18SG221TN1D​  [INDC1608X10N_0603]
L901  BLM18SG221TN1D​  [INDC1608X10N_0603]
L902  BLM18SG221TN1D​  [INDC1608X10N_0603]
L903  BLM18SG221TN1D​  [INDC1608X10N_0603]
L904  BLM18SG221TN1D​  [INDC1608X10N_0603]
L905  BLM18SG221TN1D​  [INDC1608X10N_0603]
R900  2K2,1%  [RESC1005X04N_0402]
R901  2K2,1%  [RESC1005X04N_0402]
R902  47K,1%  [RESC1005X04N_0402]
R903  27K,1%  [RESC1005X04N_0402]
R904  10K,1%  [RESC1005X04N_0402]
R905  1K,1%  [RESC1005X04N_0402]
U900  DP83867CSRGZ  [QFN50P700X700X100_HS-49N]
Y900  25MHz,18pF  [XTAL_ABM8]

### Ports
ENET_INT_N (out), RESET_N (in), RGMII_MDC (in), RGMII_MDIO (bidir), RGMII_RX_CLK (out), RGMII_RX_CTL (out), RGMII_RXD[3..0] (out), RGMII_TX_CLK (in), RGMII_TX_CTL (in), RGMII_TXD[3..0] (in)

### Nets
1V1_REG: L902.2
1V8_REG: L903.1
2V5_REG: L901.2
3V3_REG: L900.1 R900.2 R901.2
DGND: C900.1 C901.1 C902.1 C903.1 C904.1 C905.1 C906.1 C907.1 C908.1 C909.1 C910.1 C911.1 C912.1 C913.1 C914.1 C915.1 C916.1 C917.1 C918.1 C919.1 C920.1 C921.1 C922.1 C923.1 C924.1 C925.1 C926.1 C927.1 J900.10(GND) L904.1 L905.1 R903.1 R905.2 U900.49(GND_EP) Y900.2 Y900.4
ENET_INT_N: R901.1 R902.1 R902.2 R903.2 U900.44(INT/PWDN) ; port ENET_INT_N
ENET_RBIAS: R904.2 U900.12(RBIAS)
ENET_TD1_N: J900.2(TD1_N) U900.2(TD_M_A)
ENET_TD1_P: J900.1(TD1_P) U900.1(TD_P_A)
ENET_TD2_N: J900.4(TD2_N) U900.5(TD_M_B)
ENET_TD2_P: J900.3(TD2_P) U900.4(TD_P_B)
ENET_TD3_N: J900.6(TD3_N) U900.8(TD_M_C)
ENET_TD3_P: J900.5(TD3_P) U900.7(TD_P_C)
ENET_TD4_N: J900.8(TD4_N) U900.11(TD_M_D)
ENET_TD4_P: J900.7(TD4_P) U900.10(TD_P_D)
ENET_XTAL_IN: C926.2 U900.15(XI) Y900.1
ENET_XTAL_OUT: C927.2 U900.14(XO) Y900.3
RESET_N: U900.43(RESET_N) ; port RESET_N
RGMII_MDC: U900.16(MDC) ; port RGMII_MDC
RGMII_MDIO: R900.1 U900.17(MDIO) ; port RGMII_MDIO
RGMII_RX_CLK: U900.32(RX_CLK) ; port RGMII_RX_CLK
RGMII_RX_CTL: U900.38(RX_CTRL) ; port RGMII_RX_CTL
RGMII_RXD0: U900.33(RX_D0/SGMII_COP)
RGMII_RXD1: U900.34(RX_D1/SGMII_CON)
RGMII_RXD2: U900.35(RX_D2/SGMII_SOP)
RGMII_RXD3: U900.36(RX_D3/SGMII_SON)
RGMII_TX_CLK: U900.29(GTX_CLK) ; port RGMII_TX_CLK
RGMII_TX_CTL: U900.37(TX_CTRL) ; port RGMII_TX_CTL
RGMII_TXD0: U900.28(TX_D0/SGMII_SIN)
RGMII_TXD1: U900.27(TX_D1/SGMII_SIP)
RGMII_TXD2: U900.26(TX_D2)
RGMII_TXD3: U900.25(TX_D3)
NetC900_2: C900.2 C906.2 C907.2 C908.2 C909.2 C910.2 C911.2 L900.2 U900.19(VDDIO) U900.30(VDDIO) U900.41(VDDIO)
NetC901_2: C901.2 C902.2 C903.2 C904.2 C905.2 L901.1 U900.3(VDDA2P5) U900.9(VDDA2P5)
NetC912_2: C912.2 C918.2 C919.2 C920.2 C921.2 C922.2 C923.2 C924.2 C925.2 L902.1 U900.6(VDD1P0) U900.24(VDD1P0) U900.31(VDD1P0) U900.42(VDD1P0)
NetC913_2: C913.2 C914.2 C915.2 C916.2 C917.2 L903.2 U900.13(VDDA1P8) U900.48(VDDA1P8)
NetJ900_SH1: J900.SH1(A) L904.2
NetJ900_SH2: J900.SH2(A) L905.2
NetR904_1: R904.1 R905.1

Not connected (* = marked no-connect by the designer): J900 9(VCC)* 11(LED1_GRN)* 12(LED1_ANODE)* 13(LED1_ORA)* 14(LED2_ANODE)* 15(LED2_YEL)* 16(NC)*; U900 18(CLK_OUT)* 20(JTAG_CLK)* 21(JTAG_TDO)* 22(JTAG_TMS)* 23(JTAG_TDI)* 39(GPIO_0)* 40(GPIO_1)* 45(LED_2)* 46(LED_1)* 47(LED_0)*

### Buses and harness runs
bus RGMII_RXD[3..0] = port RGMII_RXD[3..0]
bus RGMII_TXD[3..0] = port RGMII_TXD[3..0]

### Layout directives
differential pair: ENET_TD1_N, ENET_TD1_P, ENET_TD2_N, ENET_TD2_P, ENET_TD3_N, ENET_TD3_P, ENET_TD4_N, ENET_TD4_P

### Notes on the sheet
- DCR = 0.040 ohms max
  2.5A max   0603 size
  220 ohms @100MHz
- (near L901) DCR = 0.040 ohms max
  2.5A max   0603 size
  220 ohms @100MHz
- (near L902) DCR = 0.040 ohms max
  2.5A max   0603 size
  220 ohms @100MHz
- (near L904) DCR = 0.040 ohms max
  2.5A max   0603 size
  220 ohms @100MHz
- Similar 0603 ferrites
  as used on Xilinx Zynq
  reference board.
- (near L905) DCR = 0.040 ohms max
  2.5A max   0603 size
  220 ohms @100MHz
- Free IO on HPS is 1v35
  ENET_INT_N_1v35 is 1.16V when ENET_INT_N not pulling low. ENET_INT_N is 3.2v in that scenario.
  Would like to pull to 1v35 instead of 3v3, however spec recommends pulling to 3v3. Worried it may bias input FETs strangely and result in excess current consumption
- (near C927) 27pF / 2 = 13.5pF load
  Datasheet has no spec for input pin capacitance.
  TI datasheet Section 9.2.1.3:
  Recommend a 18pF crystal:  As a starting point for evaluating an oscillator circuit..., CL1 and CL2 should be set at 27 pF
- CONFIDENTIAL
- Reproduction, distribution or dissemination of any part of this document without expressed written consent of SmallHD is strictly prohibited.
- Design
- Project
- Drafting
- Layout
- Sheet
- Date
- File
- Checking
- Time
- Variant
- Revision
- of
- Size
- TABLOID
- (in symbol 119) Pin 10; Pins on bottom; Pin 1; RJ8; RJ1; 100nF, 50V; Mid Mount Body / in PCB cutout; Yel / LED; Plug Tab; Ora/Grn / LED; CMC4; ESD; RJ7; CMC3; RJ6; RJ5; CMC2; RJ4; RJ3; CMC1; RJ2; 75 ohm / 1/16W; YELLOW; 1Mohm / 1/10W; 1nF / 2kV; ORANGE; GREEN; Shield
- (in symbol ICT-20164-101) VDDA2P5 / 1uF//0.1uF required for each pin / 84mA @ 105C, 1000M, 50%; VDDIO / 1.8V, 2.5V, or 3.3V / 1uF//0.1uF required for each pin / 49mA @3.3V, 23mA @1.8V, 105C, 1000M, 50%; VDDA1P8 / Apply 1.8V to reduce power / 1uF//0.1uF required for each pin / 50mA @105C, 1000M, 50%; VDD1P0 / 0.95Vmin, 1.155Vmax / 1uF//0.1uF required for each pin / 140mA @105C, 1.1V, 1000M, 50%; RGMII: Tx Control Input / Combines Tx enable and / Tx error signals on both clk edges; Media Dependent Interface / ESD Commercial Version: 6kV HBM / ESD Industrial Version: 8kV HBM; RGMII: Tx Clock Input / 125MHz clock source from MAC; Input, Internal 9k pulldown; RGMII Input, Internal 9k pulldown; Package / Top View; RGMII: Rx Control Output / Rx data available and Rx error / combined on both clk edges; RGMII:  Rx clock output / 10Mbps = 2.5MHz / 100Mbps = 25MHz / 1000Mbps = 125MHz; Output,  Internal 9k pulldown / In SGMII mode, 625MHz clk out; Output, Internal 9k pulldown / In SGMII mode, 625MHz clk out; Internal 9k pulldown; LED  Configurable I/O / Internal 9k pulldown; Management Data I/O / Bidirectional instruction data. / Requires pullup 1.5k to 2.2k; JTAG Test Clock input / Internal Pullup; Management Data Clock Input / 25MHz max, No minimum / Internal 9k pulldown; JTAG Test Data Output; JTAG Mode Sel Input / Internal Pullup; JTAG Test Data Input / Internal Pullup; Interrupt / Power Down / Power Down = Active low (default) / Interrupt open drain / Requires 2.2k pullup VDDIO / Interrupt allows MAC to act on / status change without polling; Reset 1us low minimum / Internal pullup VDDIO / Optional pin to allow HW or SW reset. / Has internal Power-on reset.; 25MHz Xtal or oscillator input  (50ppm); 25MHz clk output; Xtal output.  No Connect if oscillator used.; General Purpose I/O Configurable / Default output / Internal 9k pulldown; 11k 1% to GND

### Library data of the parts
C900 C901 C912 C913 = CAP-20026-101: as C200 on sheet microcontroller_cortexM3; Display_Name: 10uF,6V3; Dielectric: X5R; Tolerance: 20%; Voltage: 6.3V; Schematic Symbol: CAP-NP_1; smallHD PN: CAP-20026-101; Manufacturer-2: Murata
C902 C904 C907 C909 C911 C915 C917 C918 C920 C922 C924 = CAP-20025-101: as C201#1 on sheet microcontroller_cortexM3; Display_Name: 100n,6.3V; Capacitance: 0.1uF; Dielectric: X5R; Tolerance: 20%; Voltage: 6.3V; Schematic Symbol: CAP-NP_1; smallHD PN: CAP-20025-101; Manufacturer-2: Murata
C903 C905 C906 C908 C910 C914 C916 C919 C921 C923 C925 = CAP-20023-101: CAP CER 1UF 6.3V 10% X5R 0402; Manufacturer: AVX; Manufacturer Part Number: 04026D105KAT2A; Manufacturer-2 Part Number: GRM155R60J105KE19D; Capacitance: 1.0uF; Type: Ceramic; Display_Name: 1uF,6V3; Dielectric: X5R; Tolerance: 10%; Voltage: 6.3V; Schematic Symbol: CAP-NP_1; smallHD PN: CAP-20023-101; Thickness (Max): 0.56mm; Manufacturer-2: Murata
C926 C927 = CAP-20048-001: CAP CER 27PF 50V 5% NPO 0201; Manufacturer: Murata; Manufacturer Part Number: GRM0335C1H270JA01D; Type: Ceramic; Display Footprint: 0201; Display_Name: 27P,50V; Capacitance: 27PF; Dielectric: NPO; Tolerance: 5%; Voltage: 50V; Schematic Symbol: CAP-NP_1; smallHD PN: CAP-20048-001; Thickness (Max): 0.33mm
J900 = 119: CONN RJ45 MAGJACK 1PORT 1000 BASE-T; Manufacturer: Bel Fuse, Inc.; Contacts: 16; Index: 119; smallHD PN: CON-20118-001; Display_Name: 1840437-1; Series: MagJack; Type: Receptacle; Manufacturer Part Number: 1840437-1; Display Footprint: 1840437-1
L900-L905 = IND-20022-001: FERRITE CHIP 220 OHM 2.5A 0603; Manufacturer: Murata; DC Resistance: 40mOhm; Display Footprint: 0603; Display_Name: BLM18SG221TN1D​; Current Rating: 2.5A; Schematic Symbol: INDUCTOR_1; smallHD PN: IND-20022-001; Manufacturer Part Number: BLM18SG221TN1D​
R900 R901 = RES-20049-101: RES SMD 2.2K OHM 1/16W 1% 0402; Manufacturer: Yageo; Manufacturer Part Number: RC0402FR-072K2L; Manufacturer-2 Part Number: RK73H1ETTP2201F; Power: 0.0625W; Display Footprint: 0402; Display_Name: 2K2,1%; Resistance: 2K2; Tolerance: 1%; Type: Chip; Manufacturer-2: Koa Speer Electronics; Schematic Symbol: RESISTOR_1; smallHD PN: RES-20049-101
R902 = RES-20054-101: RES SMD 47K OHM 1/16W 1% 0402; Manufacturer: Yageo; Manufacturer Part Number: RC0402FR-0747KL; Manufacturer-2 Part Number: RK73H1ETTP4702F; Power: 0.0625W; Display Footprint: 0402; Display_Name: 47K,1%; Resistance: 47K; Tolerance: 1%; Type: Chip; Schematic Symbol: RESISTOR_1; Manufacturer-2: Koa Speer Electronics; smallHD PN: RES-20054-101
R903 = RES-20053-101: RES SMD 27K OHM 1/16W 1% 0402; Manufacturer: Yageo; Manufacturer Part Number: RC0402FR-0727KL; Manufacturer-2 Part Number: RK73H1ETTP2702F; Power: 0.0625W; Display Footprint: 0402; Display_Name: 27K,1%; Resistance: 27K; Tolerance: 1%; Type: Chip; Schematic Symbol: RESISTOR_1; Manufacturer-2: Koa Speer Electronics; smallHD PN: RES-20053-101
R904 = RES-20052-101: RES SMD 10K OHM 1/16W 1% 0402; Manufacturer: Yageo; Manufacturer Part Number: RC0402FR-0710KL; Manufacturer-2 Part Number: RK73H1ETTP1002F; Power: 0.0625W; Display Footprint: 0402; Display_Name: 10K,1%; Resistance: 10K; Tolerance: 1%; Type: Chip; Manufacturer-2: Koa Speer Electronics; Schematic Symbol: RESISTOR_1; smallHD PN: RES-20052-101
R905 = RES-20047-101: RES SMD 1K OHM 1/16W 1% 0402; Manufacturer: Yageo; Manufacturer Part Number: RC0402FR-071KL; Manufacturer-2 Part Number: RK73H1ETTP1001F; Power: 0.0625W; Display Footprint: 0402; Display_Name: 1K,1%; Resistance: 1K; Tolerance: 1%; Type: Chip; Manufacturer-2: Koa Speer Electronics; Schematic Symbol: RESISTOR_1; smallHD PN: RES-20047-101
U900 = ICT-20164-101: IC ETHERNET PHY 10/100/1000 RGMII SGMII 48VQFN; Manufacturer: Texas Instruments; Manufacturer-2 Part Number: DP83867ISRGZ; Temp Range: 0°C ~70°C; Display Footprint: QFN48; Display_Name: DP83867CSRGZ; Schematic Symbol: DP83867CS; smallHD PN: ICT-20164-101; Manufacturer Part Number: DP83867CSRGZ; Manufacturer-2: Texas Instruments
Y900 = XTL-20005-001: CRYSTAL 25.000MHZ 18PF SMD; Manufacturer: Abracon Corporation; Manufacturer Part Number: ABM8-25.000MHZ-B2-T; Accuracy: ±20ppm; Display Footprint: ABM8; esr_max: 50Ohms; Display_Name: 25MHz,18pF; Frequency: 25MHz; Type: Fundamental; Load Capacitance: 18pF; Schematic Symbol: XTAL_2; smallHD PN: XTL-20005-001

## Nets that join several sheets
3V3_REG: microcontroller_cortexM3 (14 pins), ethernet (L900.1 R900.2 R901.2)
DGND: top level (5 pins), microcontroller_cortexM3 (18 pins), ethernet (36 pins)

## Assembly variants
POP-20062-001: all parts fitted